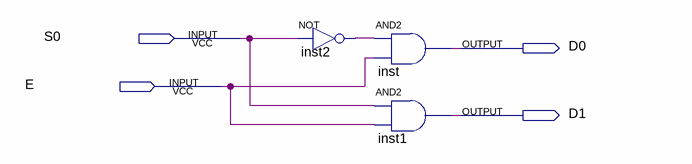
[diagram p0: schematic sheet]
// Quartus schematic dc2.bdf as structural Verilog: 3 symbols, 4 pins
module dc2 (
  input  S0,
  input  E,
  output D0,
  output D1
);

  wire inst2_out;

  not inst2 (inst2_out, S0);
  and inst (D0, inst2_out, E);
  and inst1 (D1, S0, E);
endmodule
